# EAGLE design Codeshelf-0004.v01 (EAGLE 5.11)
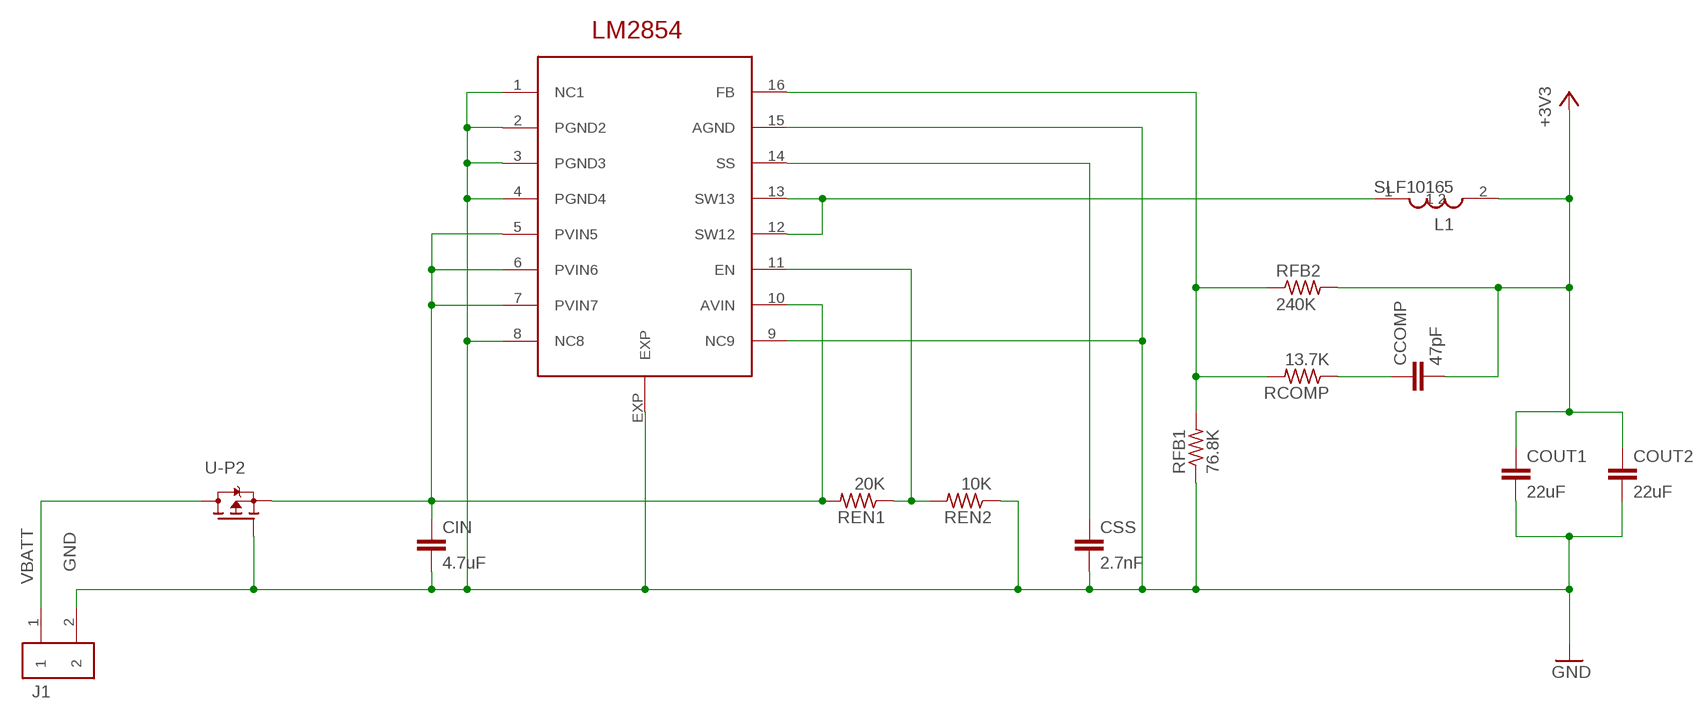
[diagram p0: schematic, sheet 1]

## Parts
CCOMP  47pF  RF-C0402  [RF-C0402]
CIN  4.7uF  RF-C0805  [RF-C0805]
COUT1  22uF  RF-C0805  [RF-C0805]
COUT2  22uF  RF-C0805  [RF-C0805]
CSS  2.7nF  RF-C0805  [RF-C0805]
J1  HEADER-2X-2.54MM  [HEADER-2X-RA-2.54MM]
L1  SLF10165  [SLF10165]
RCOMP  13.7K  RF-R0402  [RF-R0402]
REN1  20K  RF-R0402  [RF-R0402]
REN2  10K  RF-R0402  [RF-R0402]
RFB1  76.8K  RF-R0402  [RF-R0402]
RFB2  240K  RF-R0805  [RF-C0805]
U-P1  LM2854MH  [HTSSOP16PWP]
U-P2  PCHANNEL-MOSFET-DPAK  [DPAK]

## Nets
+3V3: CCOMP.2 COUT1.1 COUT2.1 L1.2 RFB2.2
GND: CIN.2 COUT1.2 COUT2.2 CSS.2 J1.2 REN2.1 RFB1.1 U-P1.1(NC1) U-P1.2(PGND2) U-P1.3(PGND3) U-P1.4(PGND4) U-P1.8(NC8) U-P1.9(NC9) U-P1.15(AGND) U-P1.EXP U-P2.1(G)
N$1: CSS.1 U-P1.14(SS)
N$2: L1.1 U-P1.12(SW12) U-P1.13(SW13)
N$3: RCOMP.2 RFB1.2 RFB2.1 U-P1.16(FB)
N$4: CCOMP.1 RCOMP.1
N$6: REN1.1 REN2.2 U-P1.11(EN)
V-PROT: CIN.1 REN1.2 U-P1.5(PVIN5) U-P1.6(PVIN6) U-P1.7(PVIN7) U-P1.10(AVIN) U-P2.3(S)
VBATT: J1.1 U-P2.4(D)

## Library data of the parts
CCOMP CIN COUT1 COUT2 CSS = GW-devices:RF-C: RF capacitor pads for FSL reference design
J1 = GW-devices:HEADER-2X: 2 position pin header
L1 = GW-devices:SLF10165
RCOMP REN1 REN2 RFB1 RFB2 = GW-devices:RF-R: RF resistor pads for FSL reference design
U-P1 = GW-devices:LM2854
U-P2 = GW-devices:PCHANNEL-MOSFET

## Board
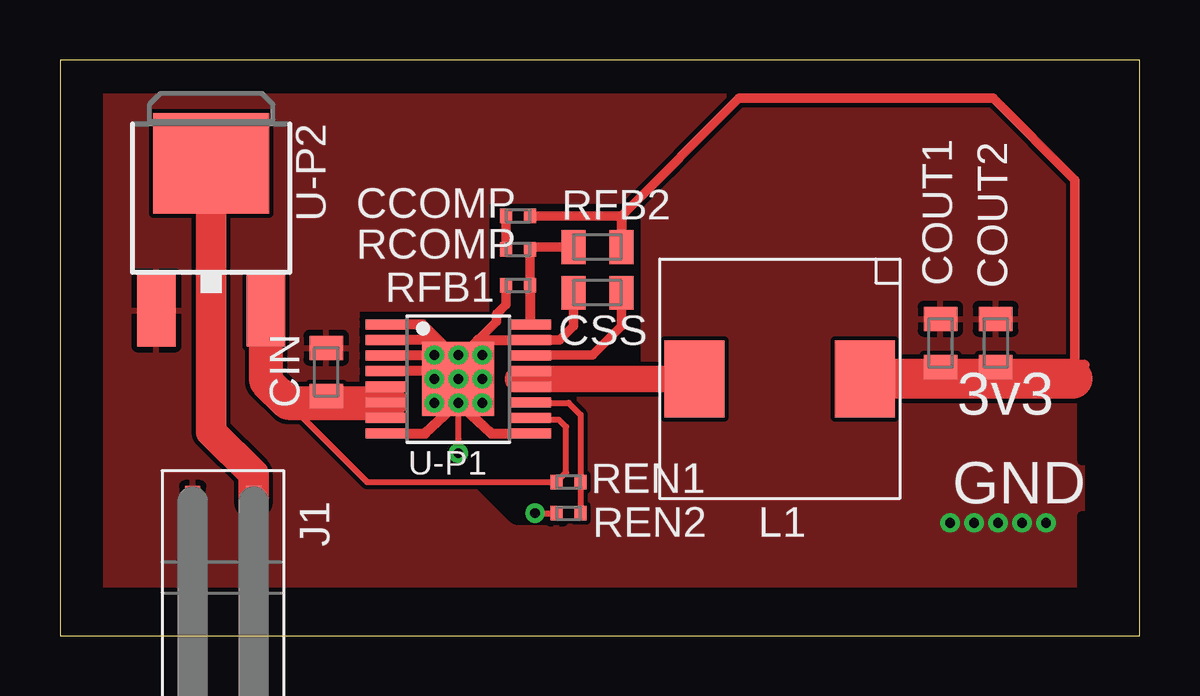
[diagram p1: board, top side]
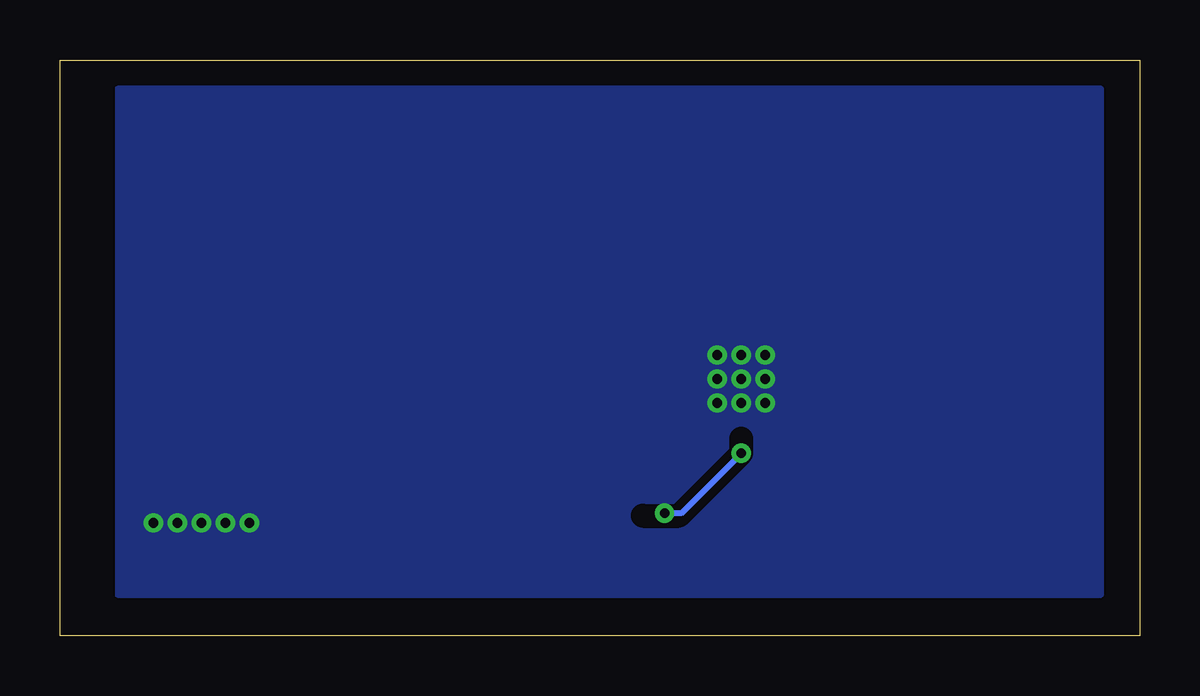
[diagram p2: board, bottom side, seen from below]

Size 45 x 24 mm. Coordinates in mm from the lower left corner, seen from the top.
Outline: 0,0 45,0 45,24 0,24 0,0
Copper layers (1*16): Top 0.0356mm / dielectric 1.5011mm / Bottom 0.0356mm
Design rules "SilverCircuits": minimum track width 7mil, minimum drill 14mil, track to track 7mil, track to pad 7mil, pad to pad 7mil, via to via 7mil, smd to smd 0mil, copper to edge 20mil, drill to drill 8mil, minimum pad ring 10mil, minimum via ring 8mil, stop-mask expansion 4mil, vias tented up to drill 0mil, thermal gap 10mil
tRestrict: area 12.5,10.7 to 14.4,13.2; area 12.5,8 to 14.6,8.7; area 18.6,8 to 20.5,8.7; area 18.6,12 to 20.7,12.6; area 12.5,12.8 to 19.2,13.5; area 14.5,8.1 to 19.1,13.3; area 17.9,11.2 to 24.2,18; 12 lines
bRestrict: 3 lines

### Footprints (pad centres in the part's own frame; a part is rotated, then mirrored left to right if it is on the bottom)
RF-C0402 = smd 0.5 x 0.6: 1 -0.5,0; 2 0.5,0
RF-C0805 = smd 1 x 1.4: 1 -1,0; 2 1,0
HEADER-2X-RA-2.54MM = smd 1.27 x 0.635: 1 0,1.27; 2 0,-1.27
SLF10165 = smd 2.5 x 3.2: 1 -3.55,0; 2 3.55,0
RF-R0402 = smd 0.5 x 0.6: 1 -0.5,0; 2 0.5,0
HTSSOP16PWP = smd 0.42 x 1.78: 1 -2.275,-2.975; 2 -1.625,-2.975; 3 -0.975,-2.975; 4 -0.325,-2.975; 5 0.325,-2.975; 6 0.975,-2.975; 7 1.625,-2.975; 8 2.275,-2.975; 9 2.275,2.975; 10 1.625,2.975; 11 0.975,2.975; 12 0.325,2.975; 13 -0.325,2.975; 14 -0.975,2.975; 15 -1.625,2.975; 16 -2.275,2.975 | smd 3.1 x 3: EXP 0,0
DPAK = smd 1.6 x 3: 1 -2.28,-4.04; 3 2.28,-4.04 | smd 4.826 x 4.191: 4 0,2.096

### Placement (x,y rotation side)
CCOMP  19.1,17.5 0 top
CIN  11.1,11 90 top
COUT1  36.7,12.2 90 top
COUT2  39,12.2 90 top
CSS  22.4,14.3 180 top
J1  6.8,5.6 270 top
L1  30,10.7 0 top
RCOMP  19.1,16.1 0 top
REN1  21.2,6.4 180 top
REN2  21.2,5.1 0 top
RFB1  19.1,14.6 0 top
RFB2  22.4,16.2 0 top
U-P1  16.6,10.7 270 top
U-P2  6.3,17.6 0 top

### Tracks (layer width: path | path; a pad name or v marks a point on that pad's centre or on a via)
+3V3
  Top 0.4: CCOMP.2 23.4,17.5 28.3,22.4 38.9,22.4 42.3,19 42.3,10.8 42.2,10.7
  Top 0.406: COUT2.1 COUT1.1 | COUT2.1 40.5,11.2 | COUT2.1 42.7,11.3 41.8,10.7 | 23.4,17.5 RFB2.2
  Top 1.676: L1.2 41.8,10.7 42.2,10.7
GND  (via drill 0.4)
  Top 0.25: v19.8,5.1 REN2.1 | v16.6,7.6 v16.6,9.7 U-P1.EXP
  Top 0.254: 15.6,11.68 v15.6,11.7 | v15.6,9.7 v15.6,10.7 U-P1.EXP | v17.6,10.7 U-P1.EXP | v16.6,9.7 v17.6,10.7 | v17.6,10.7 v17.6,9.7 | v17.6,10.7 v17.6,11.7 | U-P1.EXP v16.6,11.7 | U-P1.EXP 16.6,11.18 16.1,11.68
  Top 0.4: 19.3,12.32 20.82,12.32 21.4,12.9 CSS.2 | v16.6,11.7 16.8,11.7 | RFB1.1 18.6,13.8 18.2,13.4 18.2,13.1 17.43,12.32
  Top 0.406: U-P1.1 15.12,12.97 15.78,12.32 | 15.78,12.32 U-P1.2 | 16.43,11.68 15.78,12.32 | 16.43,11.68 16.1,11.68 15.6,11.68 U-P1.3 | 16.43,11.68 16.6,11.5 17.43,12.32 19.3,12.32 U-P1.15 | U-P1.4 16.27,11.03 U-P1.EXP | U-P1.8 15.22,8.43 v16.6,9.7 17.98,8.43 U-P1.9
  Bottom 0.25: v19.8,5.1 19.1,5.1 v16.6,7.6
  other vias: 16.6,10.7 37.1,4.7 38.1,4.7 39.1,4.7 40.1,4.7 41.1,4.7
  pour Top: 1.6,22.8 42.6,22.8 42.6,1.7 1.6,1.7
  pour Bottom: 1.6,22.8 42.6,22.8 42.6,1.7 1.6,1.7
N$1
  Top 0.4: CSS.1 23.4,12.9 22.2,11.7 19.6,11.7 U-P1.14
N$2
  Top 0.406: U-P1.12 U-P1.13 19.1,10.7
  Top 1.1: 19.1,10.7 L1.1
N$3
  Top 0.25: RCOMP.2 19.7,16.2
  Top 0.4: RFB1.2 RCOMP.2 | 19.7,16.2 RFB2.1
  Top 0.406: RFB1.2 19.6,13 U-P1.16
N$4
  Top 0.4: CCOMP.1 RCOMP.1
N$6
  Top 0.25: REN1.1 21.7,9.2 21.2,9.7 19.6,9.7
  Top 0.254: REN1.1 REN2.2 | U-P1.11 19.6,9.7
V-PROT
  Top 0.25: 19.65,9 20.8,9 21.1,8.7 21.1,6.8 REN1.2 12.8,6.4 9.5,9.7 | CIN.1 11.1,9.8 11.2,9.7
  Top 0.254: 19.65,9 U-P1.10
  Top 0.406: U-P1.6 U-P1.5 | 13.6,9.7 13.6,9.1 U-P1.7
  Top 1.422: 13.6,9.7 11.2,9.7 9.5,9.7 8.6,10.6 8.6,13.54 U-P2.3
  Top 1.676: 13.6,9.7 U-P1.6
VBATT
  Top 1.27: J1.1 8.07,6.73 6.3,8.5 U-P2.4

### Text on the board
tPlace: 3v3 | GND